# Altium project CTDSP.PrjPcb
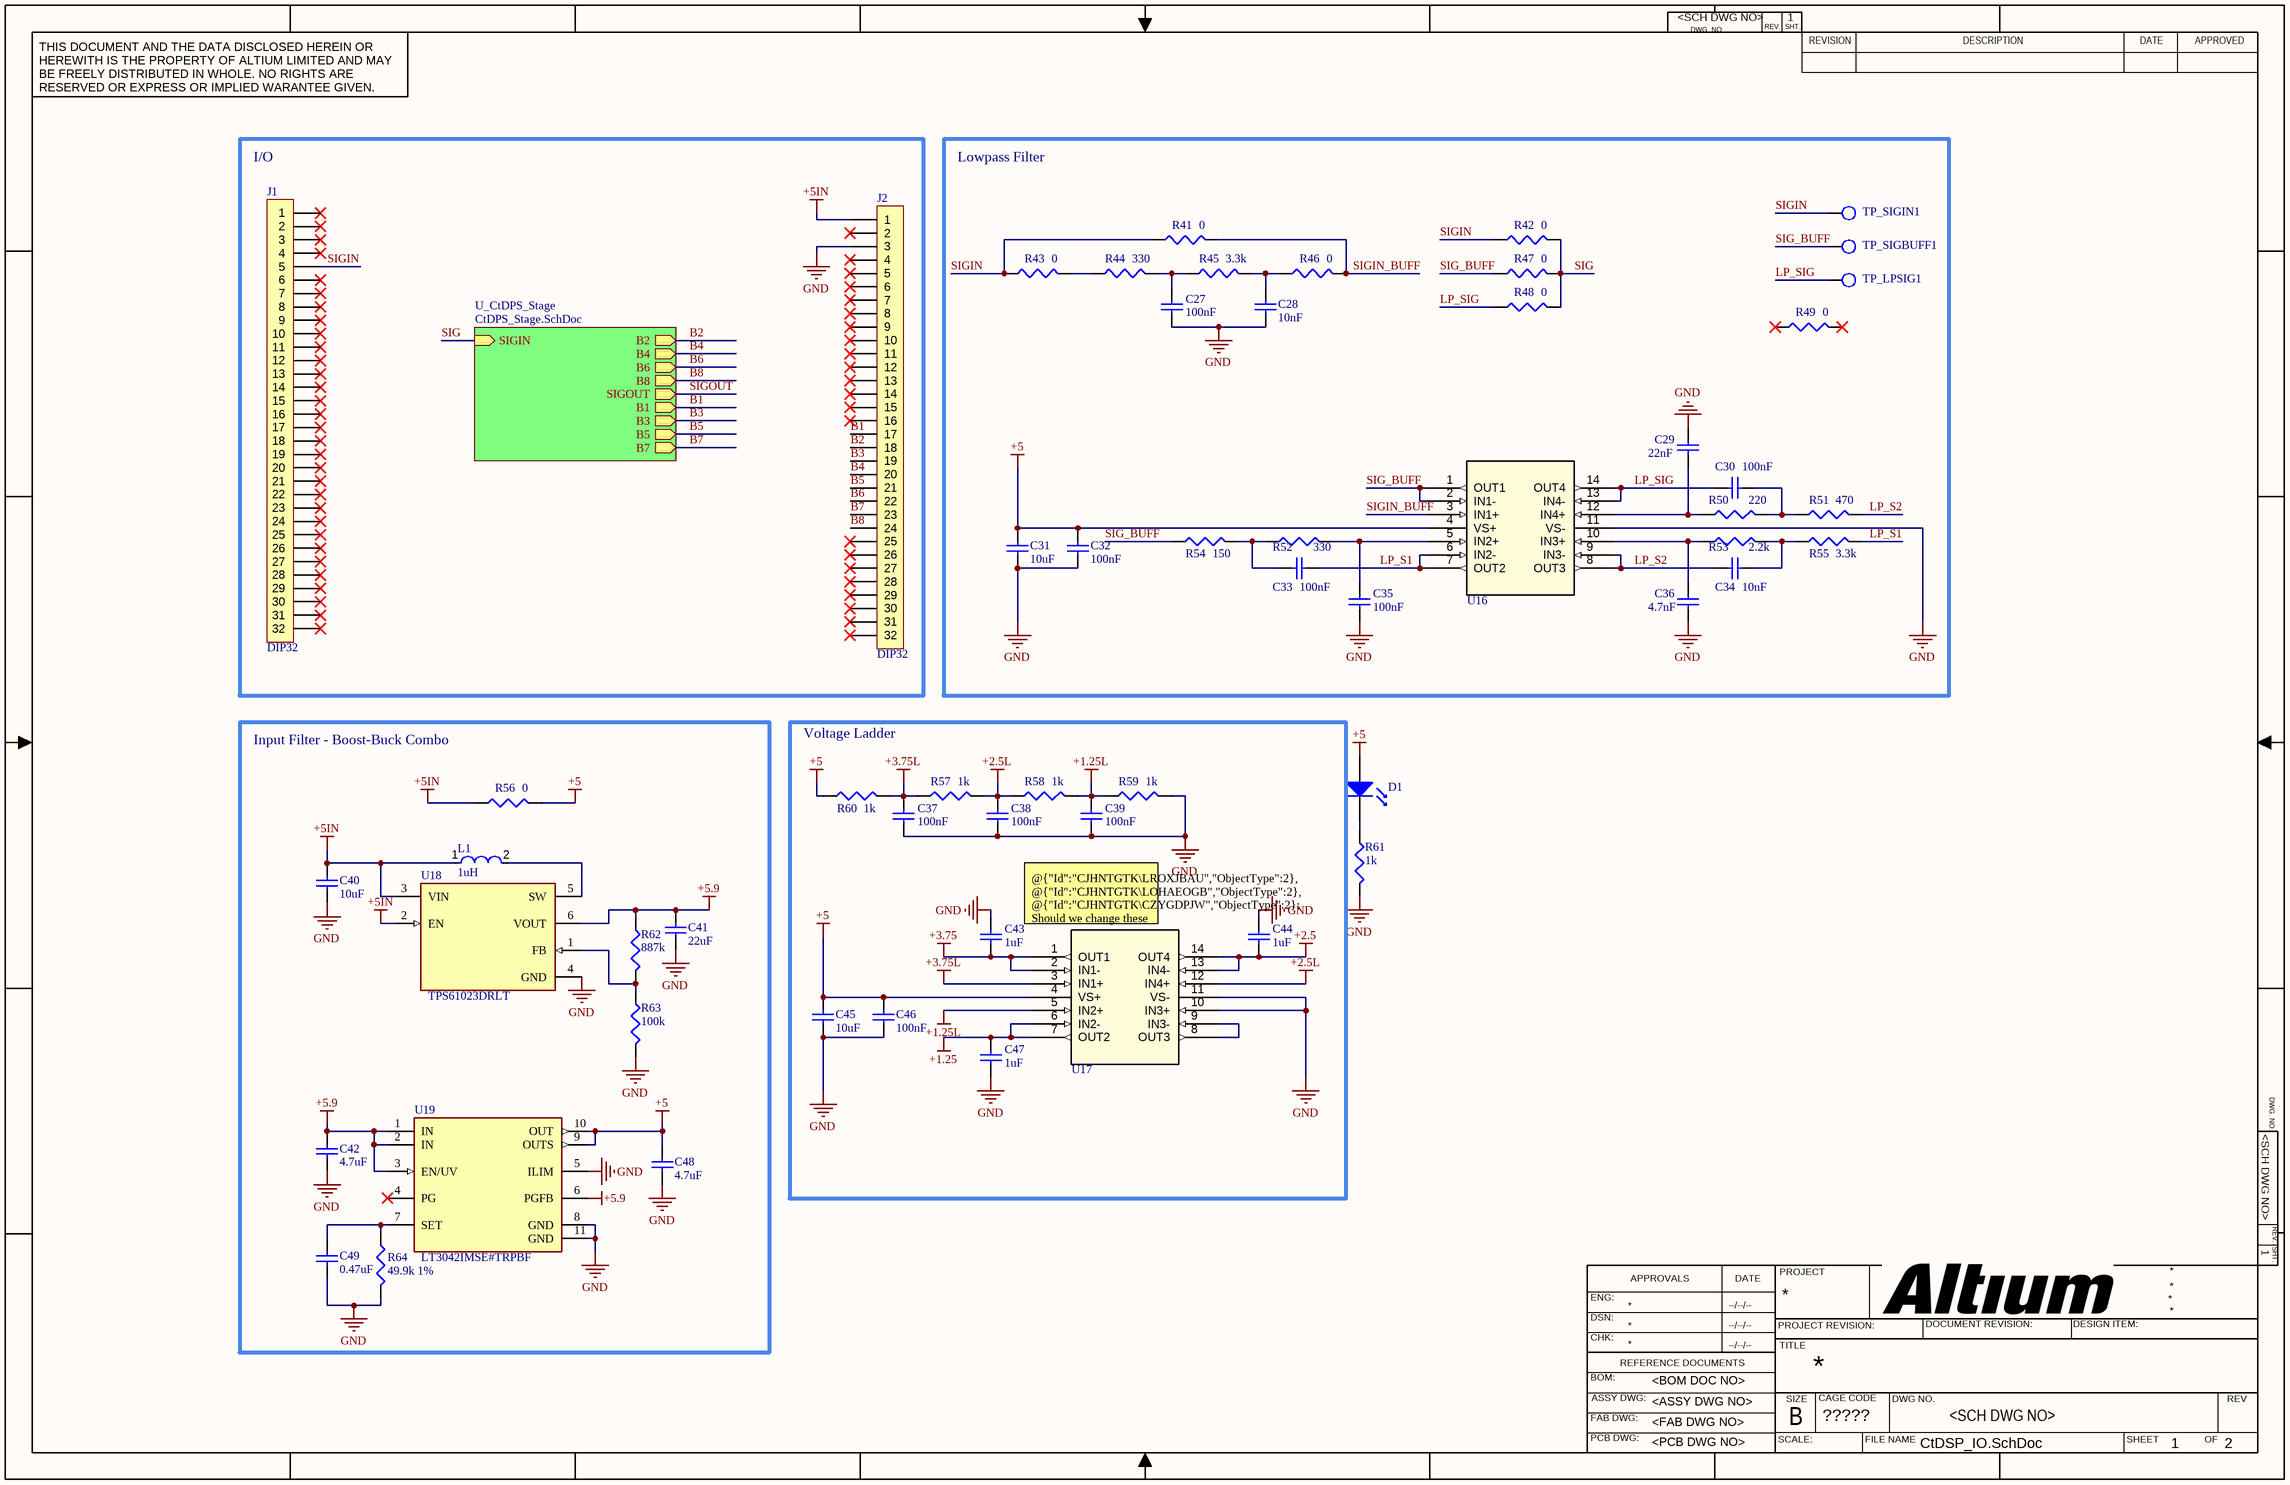
[diagram p0: CtDSP_IO.SchDoc]
CAGE_CODE: ?????; CONTRACT_NUMBER: <CONTRACT NO>; DOC_NO_ASSY_DWG: <ASSY DWG NO>; DOC_NO_BOM: <BOM DOC NO>; DOC_NO_FAB_DWG: <FAB DWG NO>; DOC_NO_SCH_DWG: <SCH DWG NO>; PCB_2_DEC_TOL: +/-.01; PCB_3_DEC_TOL: +/-.010; PCB_ANG_TOL: +/-1/2; PCB_ASSEMBLY_NO: <PCB ASSY NO>; PCB_CHECKER: - -----; PCB_CHECKER_APP_DATE: --/--/----; PCB_DESIGNER: - -----; PCB_DESIGNER_APP_DATE: --/--/----; PCB_DWG_NO: <PCB DWG NO>; PCB_ENGINEER: - -----; PCB_ENGINEER_APP_DATE: --/--/----; PCB_PART_NUMBER: <PCB PN>; PCB_REV: A; SCH_REV: A
2 sheets, 147 parts. Net scope: hierarchical (ports join the sheet entries above them; power ports are global).
Board files: PCB1.PcbDoc, PCB2.PcbDoc
Sheets:
  CtDSP_IO.SchDoc
    U_CtDPS_Stage = CtDPS_Stage.SchDoc

## Sheet CtDSP_IO.SchDoc
size 431 x 279 mm; SheetNumber: 1; SheetTotal: 2; ENG_APP_DATE: --/--/--; DSN_APP_DATE: --/--/--; CHK_APP_DATE: --/--/--

### Parts
C27  100nF  [C_0402]
C28  10nF  [C_0402]
C29  22nF  [C_0402]
C30  100nF  [C_0402]
C31  10uF  [C_0402]
C32  100nF  [C_0402]
C33  100nF  [C_0402]
C34  10nF  [C_0402]
C35  100nF  [C_0402]
C36  4.7nF  [C_0402]
C37  100nF  [C_0402]
C38  100nF  [C_0402]
C39  100nF  [C_0402]
C40  10uF  [C_0402]
C41  22uF  [C_0603]
C42  4.7uF  [C_0603]
C43  1uF  [C_0603]
C44  1uF  [C_0603]
C45  10uF  [C_0402]
C46  100nF  [C_0402]
C47  1uF  [C_0603]
C48  4.7uF  [C_0603]
C49  0.47uF  [C_0603]
D1  LED_0603  [LED_6003]  (value not drawn)
J1  DIP32  [DIP32]
J2  DIP32  [DIP32]
L1  1uH  [FP-MLP1005D-IPC_C]
R41  0  [RES_1206]
R42  0  [RES_1206]
R43  0  [RES_1206]
R44  330  [RES_0603]
R45  3.3k  [RES_0603]
R46  0  [RES_1206]
R47  0  [RES_1206]
R48  0  [RES_1206]
R49  0  [RES_1206]
R50  220  [RES_0402]
R51  470  [RES_0402]
R52  330  [RES_0603]
R53  2.2k  [RES_0603]
R54  150  [RES_0603]
R55  3.3k  [RES_0603]
R56  0  [RES_1206]
R57  1k  [RES_0603]
R58  1k  [RES_0603]
R59  1k  [RES_0603]
R60  1k  [RES_0603]
R61  1k  [RES_0402]
R62  887k  [RES_0402]
R63  100k  [RES_0402]
R64  49.9k 1%  [RES_0603]
TP_LPSIG1  TESTPOINT  [TESTPOINT]  (value not drawn)
TP_SIGBUFF1  TESTPOINT  [TESTPOINT]  (value not drawn)
TP_SIGIN1  TESTPOINT  [TESTPOINT]  (value not drawn)
U16  ADA4891-4ARZ-R7  [ADA4891-4ARZ-R7]  (value not drawn)
U17  ADA4891-4ARZ-R7  [ADA4891-4ARZ-R7]  (value not drawn)
U18  TPS61023DRLT  [FP-DRL0006A-MFG]
U19  LT3042IMSE#TRPBF  [FP-MSE-10-05-08-1664-IPC_A]

### Blocks framed on the sheet
I/O: J1 J2
Lowpass Filter: C27-C36 R41-R55 TP_LPSIG1 TP_SIGBUFF1 TP_SIGIN1 U16
Input Filter - Boost-Buck Combo: C40-C42 C48 C49 L1 R56 R62-R64 U18 U19
Voltage Ladder: C37-C39 C43-C47 R57-R60 U17

### Sub-sheets
U_CtDPS_Stage = CtDPS_Stage.SchDoc: B2 (out), B4 (out), B6 (out), B8 (out), SIGIN (in), SIGOUT (out), B1 (out), B3 (out), B5 (out), B7 (out)

### Nets
+1.25: C47.2 U17.6(IN2-) U17.7(OUT2)
+1.25L: C39.2 R58.2 R59.1 U17.5(IN2+)
+2.5: C44.1 U17.13(IN4-) U17.14(OUT4)
+2.5L: C38.2 R57.2 R58.1 U17.12(IN4+)
+3.75: C43.1 U17.1(OUT1) U17.2(IN1-)
+3.75L: C37.2 R57.1 R60.2 U17.3(IN1+)
+5: C31.1 C32.2 C45.1 C46.2 C48.2 D1.2(K) R56.2 R60.1 U16.4(VS+) U17.4(VS+) U19.9(OUTS) U19.10(OUT)
+5.9: C41.2 C42.2 R62.1 U18.6(VOUT) U19.1(IN) U19.2(IN) U19.3(EN/UV) U19.6(PGFB)
+5IN: C40.2 J2.1 L1.1 R56.1 U18.2(EN) U18.3(VIN)
GND: C27.1 C28.1 C29.2 C31.2 C32.1 C35.1 C36.1 C37.1 C38.1 C39.1 C40.1 C41.1 C42.1 C43.2 C44.2 C45.2 C46.1 C47.1 C48.1 C49.1 J2.3 R59.2 R61.2 R63.2 R64.2 U16.11(VS-) U17.10(IN3+) U17.11(VS-) U18.4(GND) U19.5(ILIM) U19.8(GND) U19.11(GND)
B1: J2.17 ; sheet U_CtDPS_Stage/B1
B2: J2.18 ; sheet U_CtDPS_Stage/B2
B3: J2.19 ; sheet U_CtDPS_Stage/B3
B4: J2.20 ; sheet U_CtDPS_Stage/B4
B5: J2.21 ; sheet U_CtDPS_Stage/B5
B6: J2.22 ; sheet U_CtDPS_Stage/B6
B7: J2.23 ; sheet U_CtDPS_Stage/B7
B8: J2.24 ; sheet U_CtDPS_Stage/B8
LP_S1: C33.1 R55.2 U16.6(IN2-) U16.7(OUT2)
LP_S2: C34.1 R51.2 U16.8(OUT3) U16.9(IN3-)
LP_SIG: C30.2 R48.1 TP_LPSIG1.1 U16.13(IN4-) U16.14(OUT4)
SIG: R42.2 R47.2 R48.2 ; sheet U_CtDPS_Stage/SIGIN
SIG_BUFF: R47.1 R54.1 TP_SIGBUFF1.1 U16.1(OUT1) U16.2(IN1-)
SIGIN: J1.5 R41.1 R42.1 R43.1 TP_SIGIN1.1
SIGIN_BUFF: R41.2 R46.2 U16.3(IN1+)
NetC27_2: C27.2 R44.2 R45.1
NetC28_2: C28.2 R45.2 R46.1
NetC29_1: C29.1 R50.1 U16.12(IN4+)
NetC30_1: C30.1 R50.2 R51.1
NetC33_2: C33.2 R52.1 R54.2
NetC34_2: C34.2 R53.2 R55.1
NetC35_2: C35.2 R52.2 U16.5(IN2+)
NetC36_2: C36.2 R53.1 U16.10(IN3+)
NetC49_2: C49.2 R64.1 U19.7(SET)
NetD1_1: D1.1(A) R61.1
NetL1_2: L1.2 U18.5(SW)
NetR43_2: R43.2 R44.1
NetR62_2: R62.2 R63.1 U18.1(FB)
NetU17_8: U17.8(OUT3) U17.9(IN3-)

Not connected (* = marked no-connect by the designer): J1 1* 2* 3* 4* 6* 7* 8* 9* 10* 11* 12* 13* 14* 15* 16* 17* 18* 19* 20* 21* 22* 23* 24* 25* 26* 27* 28* 29* 30* 31* 32*; J2 2* 4* 5* 6* 7* 8* 9* 10* 11* 12* 13* 14* 15* 16* 25* 26* 27* 28* 29* 30* 31* 32*; R49 1* 2*; U19 4(PG)*

### Notes on the sheet
- @{"Id":"CJHNTGTK\LROXJBAU","ObjectType":2}, @{"Id":"CJHNTGTK\LOHAEOGB","ObjectType":2}, @{"Id":"CJHNTGTK\CZYGDPJW","ObjectType":2}; Should we change these bulk cap values?
- DWG. NO.
- REV.
- SHT.
- THIS DOCUMENT AND THE DATA DISCLOSED HEREIN OR HEREWITH IS THE PROPERTY OF ALTIUM LIMITED AND MAY BE FREELY DISTRIBUTED IN WHOLE. NO RIGHTS ARE RESERVED OR EXPRESS OR IMPLIED WARANTEE GIVEN.
- REVISION
- DESCRIPTION
- DATE
- APPROVED
- ENG:
- APPROVALS
- PROJECT
- DSN:
- CHK:
- REFERENCE DOCUMENTS
- PROJECT REVISION:
- TITLE
- DOCUMENT REVISION:
- DESIGN ITEM:
- BOM:
- FAB DWG:
- PCB DWG:
- ASSY DWG:
- SCALE:
- SIZE
- B
- CAGE CODE
- FILE NAME
- DWG NO.
- SHEET
- OF
- REV

### Library data of the parts
C27-C42 C45 C46 C48 C49 = C_0402
  C27 C30 C32 C33 C35 C37-C39 C46: LCSC Part #: C1525
  C28 C34: LCSC Part #: C15195
  C29: LCSC Part #: C1532
  C31 C40 C45: LCSC Part #: C15525
  C36: LCSC Part #: C1538
  C41: LCSC Part #: C59461
  C42 C48: LCSC Part #: C19666
  C49: LCSC Part #: C1623
C43 C44 C47 = C_0603: LCSC Part #: C15849
L1 = CMP-08253-000043-1: FIXED IND 1UH 500MA 689 MOHM SMD; Test Frequency: 10MHz; Shielding: Shielded; DC Resistance (DCR): 689mR; Tolerance: 20%; Core Material: Ferrite; Case/Package: 0402; Packaging: Tape and Reel; Height - Seated (Max): 0.03inch; Termination: SMD/SMT; Weight: 2.3E-05oz; Mount: Surface Mount; Height: 0.75mm; RoHS Compliant: Yes; Max DC Current: 500mA; Case Code (Metric): 1005; Width: 0.02inch; Current Rating: 500mA; Length: 0.039inch; Package Quantity: 8000; Case Code (Imperial): 0402; Max Operating Temperature: 125°C; Min Operating Temperature: -40°C; Inductance: 1uH; LCSC Part #: C531284
R41-R43 R46-R49 R56 = RES_1206: LCSC Part #: C17888
R44 R45 R52-R55 R57-R60 = RES_0603
  R44 R52: LCSC Part #: C23138
  R45 R55: LCSC Part #: C22978
  R53: LCSC Part #: C4190
  R54: LCSC Part #: C22808
  R57-R60: LCSC Part #: C5123612
R50 R51 R61-R64 = RES_0402
  R50: LCSC Part #: C25091
  R51: LCSC Part #: C25117
  R61: LCSC Part #: C11702
  R62: LCSC Part #: C11547
  R63: LCSC Part #: C25741
  R64: LCSC Part #: C23184
U16 U17 = ADA4891-4ARZ-R7: Quad Rail-to-Rail Op-Amp, 240 MHz, 170 V/µs, SOT-23-5; LCSC Part #: C654290
U18 = CMP-04918-000657-1: IC REG BOOST ADJ 3A SOT563; LCSC Part #: C1852149
U19 = CMP-09138-000225-1: IC REG LIN POS ADJ 200MA 10MSOP; Number of Regulators: 1; Min Current Limit: 220mA; Output Voltage: 15V; Dropout Voltage: 350mV; Series: -; RoHS Compliant: Yes; Case/Package: MSOP; Min Operating Temperature: -40°C; Packaging: Tape and Reel; Max Operating Temperature: 125°C; Number of Pins: 10; Output Current: 200mA; Mount: Surface Mount; LCSC Part #: C666569
D1 = LED_0603: LCSC Part #: C2286

## Sheet CtDPS_Stage.SchDoc
size B; SheetNumber: 2; SheetTotal: 2
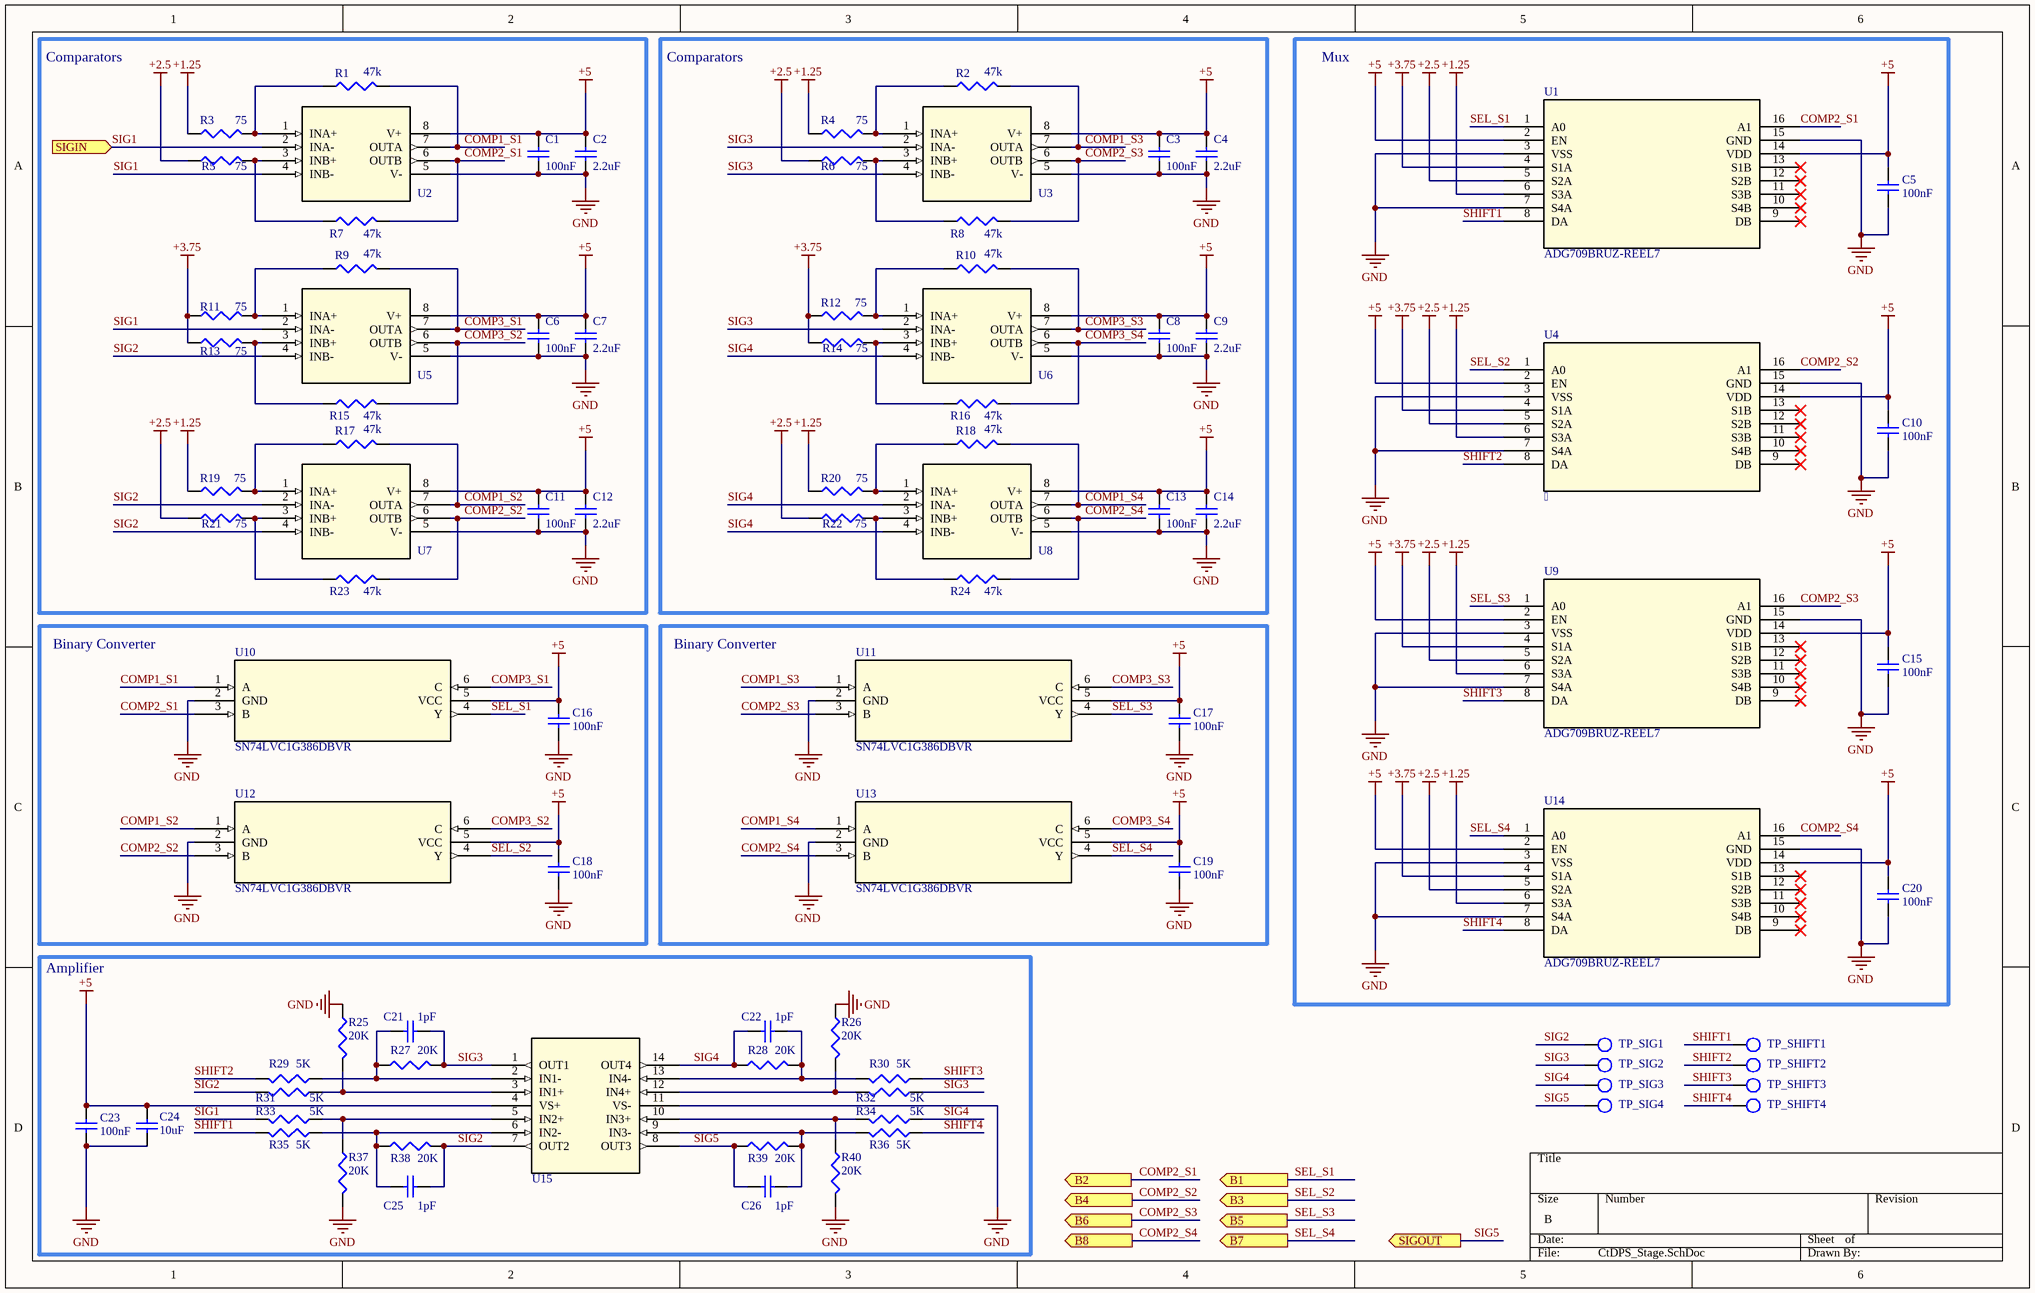
[diagram p1: CtDPS_Stage.SchDoc]

### Parts
C1  100nF  [C_0402]
C2  2.2uF  [C_0402]
C3  100nF  [C_0402]
C4  2.2uF  [C_0402]
C5  100nF  [C_0402]
C6  100nF  [C_0402]
C7  2.2uF  [C_0402]
C8  100nF  [C_0402]
C9  2.2uF  [C_0402]
C10  100nF  [C_0402]
C11  100nF  [C_0402]
C12  2.2uF  [C_0402]
C13  100nF  [C_0402]
C14  2.2uF  [C_0402]
C15  100nF  [C_0402]
C16  100nF  [C_0402]
C17  100nF  [C_0402]
C18  100nF  [C_0402]
C19  100nF  [C_0402]
C20  100nF  [C_0402]
C21  1pF  [C_0402]
C22  1pF  [C_0402]
C23  100nF  [C_0402]
C24  10uF  [C_0402]
C25  1pF  [C_0402]
C26  1pF  [C_0402]
R1  47k  [RES_0603]
R2  47k  [RES_0603]
R3  75  [RES_0603]
R4  75  [RES_0603]
R5  75  [RES_0603]
R6  75  [RES_0603]
R7  47k  [RES_0603]
R8  47k  [RES_0603]
R9  47k  [RES_0603]
R10  47k  [RES_0603]
R11  75  [RES_0603]
R12  75  [RES_0603]
R13  75  [RES_0603]
R14  75  [RES_0603]
R15  47k  [RES_0603]
R16  47k  [RES_0603]
R17  47k  [RES_0603]
R18  47k  [RES_0603]
R19  75  [RES_0603]
R20  75  [RES_0603]
R21  75  [RES_0603]
R22  75  [RES_0603]
R23  47k  [RES_0603]
R24  47k  [RES_0603]
R25  20K  [RES_0402]
R26  20K  [RES_0402]
R27  20K  [RES_0402]
R28  20K  [RES_0402]
R29  5K  [RES_0402]
R30  5K  [RES_0402]
R31  5K  [RES_0402]
R32  5K  [RES_0402]
R33  5K  [RES_0402]
R34  5K  [RES_0402]
R35  5K  [RES_0402]
R36  5K  [RES_0402]
R37  20K  [RES_0402]
R38  20K  [RES_0402]
R39  20K  [RES_0402]
R40  20K  [RES_0402]
TP_SHIFT1  TESTPOINT  [TESTPOINT]  (value not drawn)
TP_SHIFT2  TESTPOINT  [TESTPOINT]  (value not drawn)
TP_SHIFT3  TESTPOINT  [TESTPOINT]  (value not drawn)
TP_SHIFT4  TESTPOINT  [TESTPOINT]  (value not drawn)
TP_SIG1  TESTPOINT  [TESTPOINT]  (value not drawn)
TP_SIG2  TESTPOINT  [TESTPOINT]  (value not drawn)
TP_SIG3  TESTPOINT  [TESTPOINT]  (value not drawn)
TP_SIG4  TESTPOINT  [TESTPOINT]  (value not drawn)
U1  ADG709BRUZ-REEL7  [ADG709BRUZ-REEL7]
U2  TLV3502AIDR  [TLV3502AIDR]  (value not drawn)
U3  TLV3502AIDR  [TLV3502AIDR]  (value not drawn)
U4    [ADG709BRUZ-REEL7]
U5  TLV3502AIDR  [TLV3502AIDR]  (value not drawn)
U6  TLV3502AIDR  [TLV3502AIDR]  (value not drawn)
U7  TLV3502AIDR  [TLV3502AIDR]  (value not drawn)
U8  TLV3502AIDR  [TLV3502AIDR]  (value not drawn)
U9  ADG709BRUZ-REEL7  [ADG709BRUZ-REEL7]
U10  SN74LVC1G386DBVR  [SN74LVC1G386DBVR]
U11  SN74LVC1G386DBVR  [SN74LVC1G386DBVR]
U12  SN74LVC1G386DBVR  [SN74LVC1G386DBVR]
U13  SN74LVC1G386DBVR  [SN74LVC1G386DBVR]
U14  ADG709BRUZ-REEL7  [ADG709BRUZ-REEL7]
U15  ADA4891-4ARZ-R7  [ADA4891-4ARZ-R7]  (value not drawn)

### Blocks framed on the sheet
Comparators: C1 C2 C6 C7 C11 C12 R1 R3 R5 R7 R9 R11 R13 R15 R17 R19 R21 R23 U2 U5 U7
Comparators: C3 C4 C8 C9 C13 C14 R2 R4 R6 R8 R10 R12 R14 R16 R18 R20 R22 R24 U3 U6 U8
Mux: C5 C10 C15 C20 U1 U4 U9 U14
Binary Converter: C16 C18 U10 U12
Binary Converter: C17 C19 U11 U13
Amplifier: C21-C26 R25-R40 U15

### Ports
B1 (out), B2 (out), B3 (out), B4 (out), B5 (out), B6 (out), B7 (out), B8 (out), SIGIN (in), SIGOUT (out)

### Nets
+1.25: R3.1 R4.1 R19.1 R20.1 U1.6(S3A) U4.6(S3A) U9.6(S3A) U14.6(S3A)
+2.5: R5.1 R6.1 R21.1 R22.1 U1.5(S2A) U4.5(S2A) U9.5(S2A) U14.5(S2A)
+3.75: R11.1 R12.1 R13.1 R14.1 U1.4(S1A) U4.4(S1A) U9.4(S1A) U14.4(S1A)
+5: C1.1 C2.2 C3.1 C4.2 C5.1 C6.1 C7.2 C8.1 C9.2 C10.1 C11.1 C12.2 C13.1 C14.2 C15.1 C16.1 C17.1 C18.1 C19.1 C20.1 C23.1 C24.2 U1.2(EN) U1.14(VDD) U2.8(V+) U3.8(V+) U4.2(EN) U4.14(VDD) U5.8(V+) U6.8(V+) U7.8(V+) U8.8(V+) U9.2(EN) U9.14(VDD) U10.5(VCC) U11.5(VCC) U12.5(VCC) U13.5(VCC) U14.2(EN) U14.14(VDD) U15.4(VS+)
GND: C1.2 C2.1 C3.2 C4.1 C5.2 C6.2 C7.1 C8.2 C9.1 C10.2 C11.2 C12.1 C13.2 C14.1 C15.2 C16.2 C17.2 C18.2 C19.2 C20.2 C23.2 C24.1 R25.1 R26.1 R37.2 R40.2 U1.3(VSS) U1.7(S4A) U1.15(GND) U2.5(V-) U3.5(V-) U4.3(VSS) U4.7(S4A) U4.15(GND) U5.5(V-) U6.5(V-) U7.5(V-) U8.5(V-) U9.3(VSS) U9.7(S4A) U9.15(GND) U10.2(GND) U11.2(GND) U12.2(GND) U13.2(GND) U14.3(VSS) U14.7(S4A) U14.15(GND) U15.11(VS-)
COMP1_S1: R1.2 U2.7(OUTA) U10.1(A)
COMP1_S2: R17.2 U7.7(OUTA) U12.1(A)
COMP1_S3: R2.2 U3.7(OUTA) U11.1(A)
COMP1_S4: R18.2 U8.7(OUTA) U13.1(A)
COMP2_S1: R7.2 U1.16(A1) U2.6(OUTB) U10.3(B) ; port B2  [project net B2]
COMP2_S2: R23.2 U4.16(A1) U7.6(OUTB) U12.3(B) ; port B4  [project net B4]
COMP2_S3: R8.2 U3.6(OUTB) U9.16(A1) U11.3(B) ; port B6  [project net B6]
COMP2_S4: R24.2 U8.6(OUTB) U13.3(B) U14.16(A1) ; port B8  [project net B8]
COMP3_S1: R9.2 U5.7(OUTA) U10.6(C)
COMP3_S2: R15.2 U5.6(OUTB) U12.6(C)
COMP3_S3: R10.2 U6.7(OUTA) U11.6(C)
COMP3_S4: R16.2 U6.6(OUTB) U13.6(C)
SEL_S1: U1.1(A0) U10.4(Y) ; port B1  [project net B1]
SEL_S2: U4.1(A0) U12.4(Y) ; port B3  [project net B3]
SEL_S3: U9.1(A0) U11.4(Y) ; port B5  [project net B5]
SEL_S4: U13.4(Y) U14.1(A0) ; port B7  [project net B7]
SHIFT1: R35.1 TP_SHIFT1.1 U1.8(DA)
SHIFT2: R29.1 TP_SHIFT2.1 U4.8(DA)
SHIFT3: R30.2 TP_SHIFT3.1 U9.8(DA)
SHIFT4: R36.2 TP_SHIFT4.1 U14.8(DA)
SIG1: R33.1 U2.2(INA-) U2.4(INB-) U5.2(INA-) ; port SIGIN  [project net SIG]
SIG2: C25.2 R31.1 R38.2 TP_SIG1.1 U5.4(INB-) U7.2(INA-) U7.4(INB-) U15.7(OUT2)
SIG3: C21.2 R27.2 R32.2 TP_SIG2.1 U3.2(INA-) U3.4(INB-) U6.2(INA-) U15.1(OUT1)
SIG4: C22.1 R28.1 R34.2 TP_SIG3.1 U6.4(INB-) U8.2(INA-) U8.4(INB-) U15.14(OUT4)
SIG5: C26.1 R39.1 TP_SIG4.1 U15.8(OUT3) ; port SIGOUT
NetC21_1: C21.1 R27.1 R29.2 U15.2(IN1-)
NetC22_2: C22.2 R28.2 R30.1 U15.13(IN4-)
NetC25_1: C25.1 R35.2 R38.1 U15.6(IN2-)
NetC26_2: C26.2 R36.1 R39.2 U15.9(IN3-)
NetR1_1: R1.1 R3.2 U2.1(INA+)
NetR2_1: R2.1 R4.2 U3.1(INA+)
NetR5_2: R5.2 R7.1 U2.3(INB+)
NetR6_2: R6.2 R8.1 U3.3(INB+)
NetR9_1: R9.1 R11.2 U5.1(INA+)
NetR10_1: R10.1 R12.2 U6.1(INA+)
NetR13_2: R13.2 R15.1 U5.3(INB+)
NetR14_2: R14.2 R16.1 U6.3(INB+)
NetR17_1: R17.1 R19.2 U7.1(INA+)
NetR18_1: R18.1 R20.2 U8.1(INA+)
NetR21_2: R21.2 R23.1 U7.3(INB+)
NetR22_2: R22.2 R24.1 U8.3(INB+)
NetR25_2: R25.2 R31.2 U15.3(IN1+)
NetR26_2: R26.2 R32.1 U15.12(IN4+)
NetR33_2: R33.2 R37.1 U15.5(IN2+)
NetR34_1: R34.1 R40.1 U15.10(IN3+)

Not connected (* = marked no-connect by the designer): U1 9(DB)* 10(S4B)* 11(S3B)* 12(S2B)* 13(S1B)*; U4 9(DB)* 10(S4B)* 11(S3B)* 12(S2B)* 13(S1B)*; U9 9(DB)* 10(S4B)* 11(S3B)* 12(S2B)* 13(S1B)*; U14 9(DB)* 10(S4B)* 11(S3B)* 12(S2B)* 13(S1B)*

### Library data of the parts
C1-C26 = C_0402
  C1 C3 C5 C6 C8 C10 C11 C13 C15-C20 C23: LCSC Part #: C1525
  C2 C4 C7 C9 C12 C14: LCSC Part #: C12530
  C21 C22 C25 C26: LCSC Part #: C1550
  C24: LCSC Part #: C15525
R1-R24 = RES_0603
  R1 R2 R7-R10 R15-R18 R23 R24: LCSC Part #: C25819
  R3-R6 R11-R14 R19-R22: LCSC Part #: C4275
R25-R40 = RES_0402
  R25-R28 R37-R40: LCSC Part #: C25765
  R29-R36: LCSC Part #: C5948099
U1 U4 U9 U14 = ADG709BRUZ-REEL7: CMOS Low Voltage, 3 Î© 4-Channel Multiplexer; LCSC Part #: C206785
U2 U3 U5-U8 = TLV3502AIDR: Dual 4.5ns Push-pull Rail-to-Rail Input, Rail-to-Rail Output TTL Comparators; LCSC Part #: C131165
U10-U13 = SN74LVC1G386DBVR: Single 3-input, 1.65-V to 5.5-V XOR (exclusive OR) gate 6-SOT-23 -40 to 125; LCSC Part #: C2838503
U15 = ADA4891-4ARZ-R7: as U16 on sheet CtDSP_IO; LCSC Part #: C654290

## Nets that join several sheets
+1.25: CtDSP_IO (C47.2 U17.6 U17.7), CtDPS_Stage (8 pins)
+2.5: CtDSP_IO (C44.1 U17.13 U17.14), CtDPS_Stage (8 pins)
+3.75: CtDSP_IO (C43.1 U17.1 U17.2), CtDPS_Stage (8 pins)
+5: CtDSP_IO (12 pins), CtDPS_Stage (41 pins)
GND: CtDSP_IO (32 pins), CtDPS_Stage (49 pins)
B1: CtDSP_IO (J2.17), CtDPS_Stage (U1.1 U10.4)
B2: CtDSP_IO (J2.18), CtDPS_Stage (R7.2 U1.16 U2.6 U10.3)
B3: CtDSP_IO (J2.19), CtDPS_Stage (U4.1 U12.4)
B4: CtDSP_IO (J2.20), CtDPS_Stage (R23.2 U4.16 U7.6 U12.3)
B5: CtDSP_IO (J2.21), CtDPS_Stage (U9.1 U11.4)
B6: CtDSP_IO (J2.22), CtDPS_Stage (R8.2 U3.6 U9.16 U11.3)
B7: CtDSP_IO (J2.23), CtDPS_Stage (U13.4 U14.1)
B8: CtDSP_IO (J2.24), CtDPS_Stage (R24.2 U8.6 U13.3 U14.16)
SIG: CtDSP_IO (R42.2 R47.2 R48.2), CtDPS_Stage (R33.1 U2.2 U2.4 U5.2)